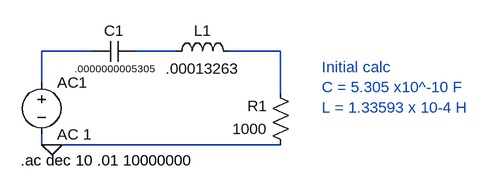
[diagram p0: schematic RLC Bandpass 1.asc]
RLC Bandpass 1.asc, the LTspice schematic file:
Version 4
SHEET 1 880 680
WIRE 112 96 32 96
WIRE 240 96 176 96
WIRE 400 96 320 96
WIRE 32 144 32 96
WIRE 400 160 400 96
WIRE 32 240 32 224
WIRE 48 240 32 240
WIRE 400 240 48 240
FLAG 48 240 0
SYMBOL res 416 256 R180
WINDOW 0 36 76 Left 2
WINDOW 3 36 40 Left 2
SYMATTR InstName R1
SYMATTR Value 1000
SYMBOL cap 176 80 R90
WINDOW 0 0 32 VBottom 2
WINDOW 3 32 32 VTop 1
SYMATTR InstName C1
SYMATTR Value .0000000005305
SYMBOL ind 224 112 R270
WINDOW 0 32 56 VTop 2
WINDOW 3 5 56 VBottom 2
SYMATTR InstName L1
SYMATTR Value .00013263
SYMBOL voltage 32 128 R0
WINDOW 123 0 0 Left 0
WINDOW 39 0 0 Left 0
SYMATTR InstName AC1
SYMATTR Value AC 1
TEXT 0 264 Left 2 !.ac dec 10 .01 10000000
TEXT 464 120 Left 2 ;Initial calc\nC = 5.305 x10^-10 F\nL = 1.33593 x 10-4 H

The netlist it stands for:
* RLC Bandpass 1.asc
R1 0 N003 1000
C1 N002 N001 .0000000005305
L1 N002 N003 .00013263
V§AC1 N001 0 AC 1
.ac dec 10 .01 10000000
* Initial calc
* C = 5.305 x10^-10 F
* L = 1.33593 x 10-4 H
.backanno
.end